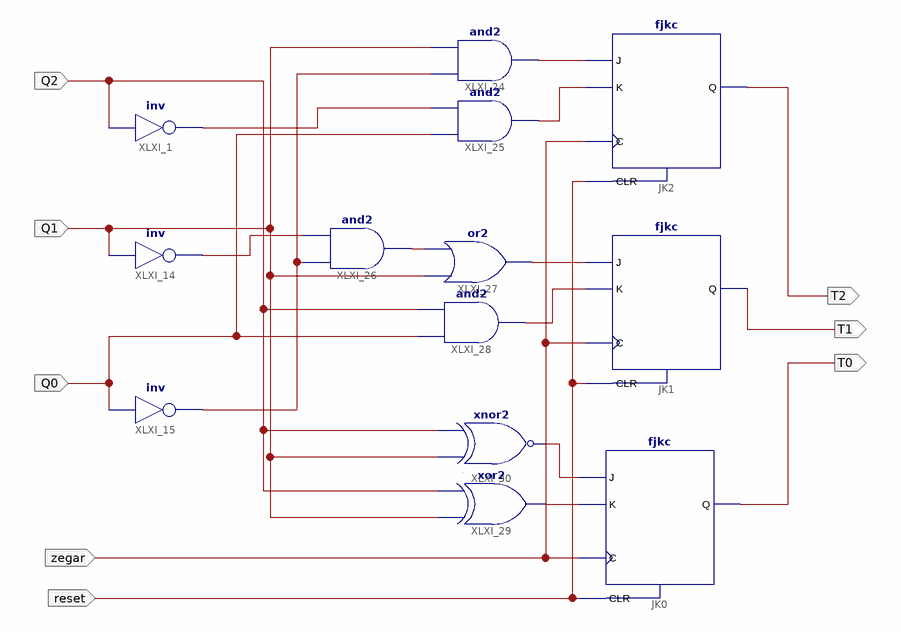
[diagram p0: schematic sheet 1]
// Xilinx ISE schematic zad1_schemat.sch (artix7) as structural Verilog: 13 symbols, 8 ports
module zad1_schemat (
  input  Q1,
  input  Q0,
  input  Q2,
  input  zegar,
  input  reset,
  output T2,
  output T1,
  output T0
);

  wire XLXN_28, XLXN_29, XLXN_30, XLXN_31, XLXN_32, XLXN_33, XLXN_34, XLXN_35, XLXN_36, XLXN_44;

  not XLXI_1 (XLXN_44, Q2);
  not XLXI_14 (XLXN_36, Q1);
  not XLXI_15 (XLXN_35, Q0);
  fjkc JK0 (.C(zegar), .CLR(reset), .J(XLXN_33), .K(XLXN_34), .Q(T0));
  fjkc JK1 (.C(zegar), .CLR(reset), .J(XLXN_29), .K(XLXN_32), .Q(T1));
  fjkc JK2 (.C(zegar), .CLR(reset), .J(XLXN_31), .K(XLXN_30), .Q(T2));
  and XLXI_24 (XLXN_31, XLXN_35, Q1);
  and XLXI_25 (XLXN_30, Q0, XLXN_44);
  and XLXI_26 (XLXN_28, XLXN_35, XLXN_36);
  or XLXI_27 (XLXN_29, Q1, XLXN_28);
  and XLXI_28 (XLXN_32, Q0, Q2);
  xor XLXI_29 (XLXN_34, Q1, Q2);
  xnor XLXI_30 (XLXN_33, Q1, Q2);
endmodule
